# EasyEDA Pro project ProProject_EquiCycle_2024-03-26.epro, schematic Schematic1
Create Date: 2024-03-20; Page Name: P1; Project Name: EquiCycle; Schematic Name: Schematic1; Update Date: 2024-03-25; Company: 嘉立创EDA; Page Size: A4; Version: V1.0
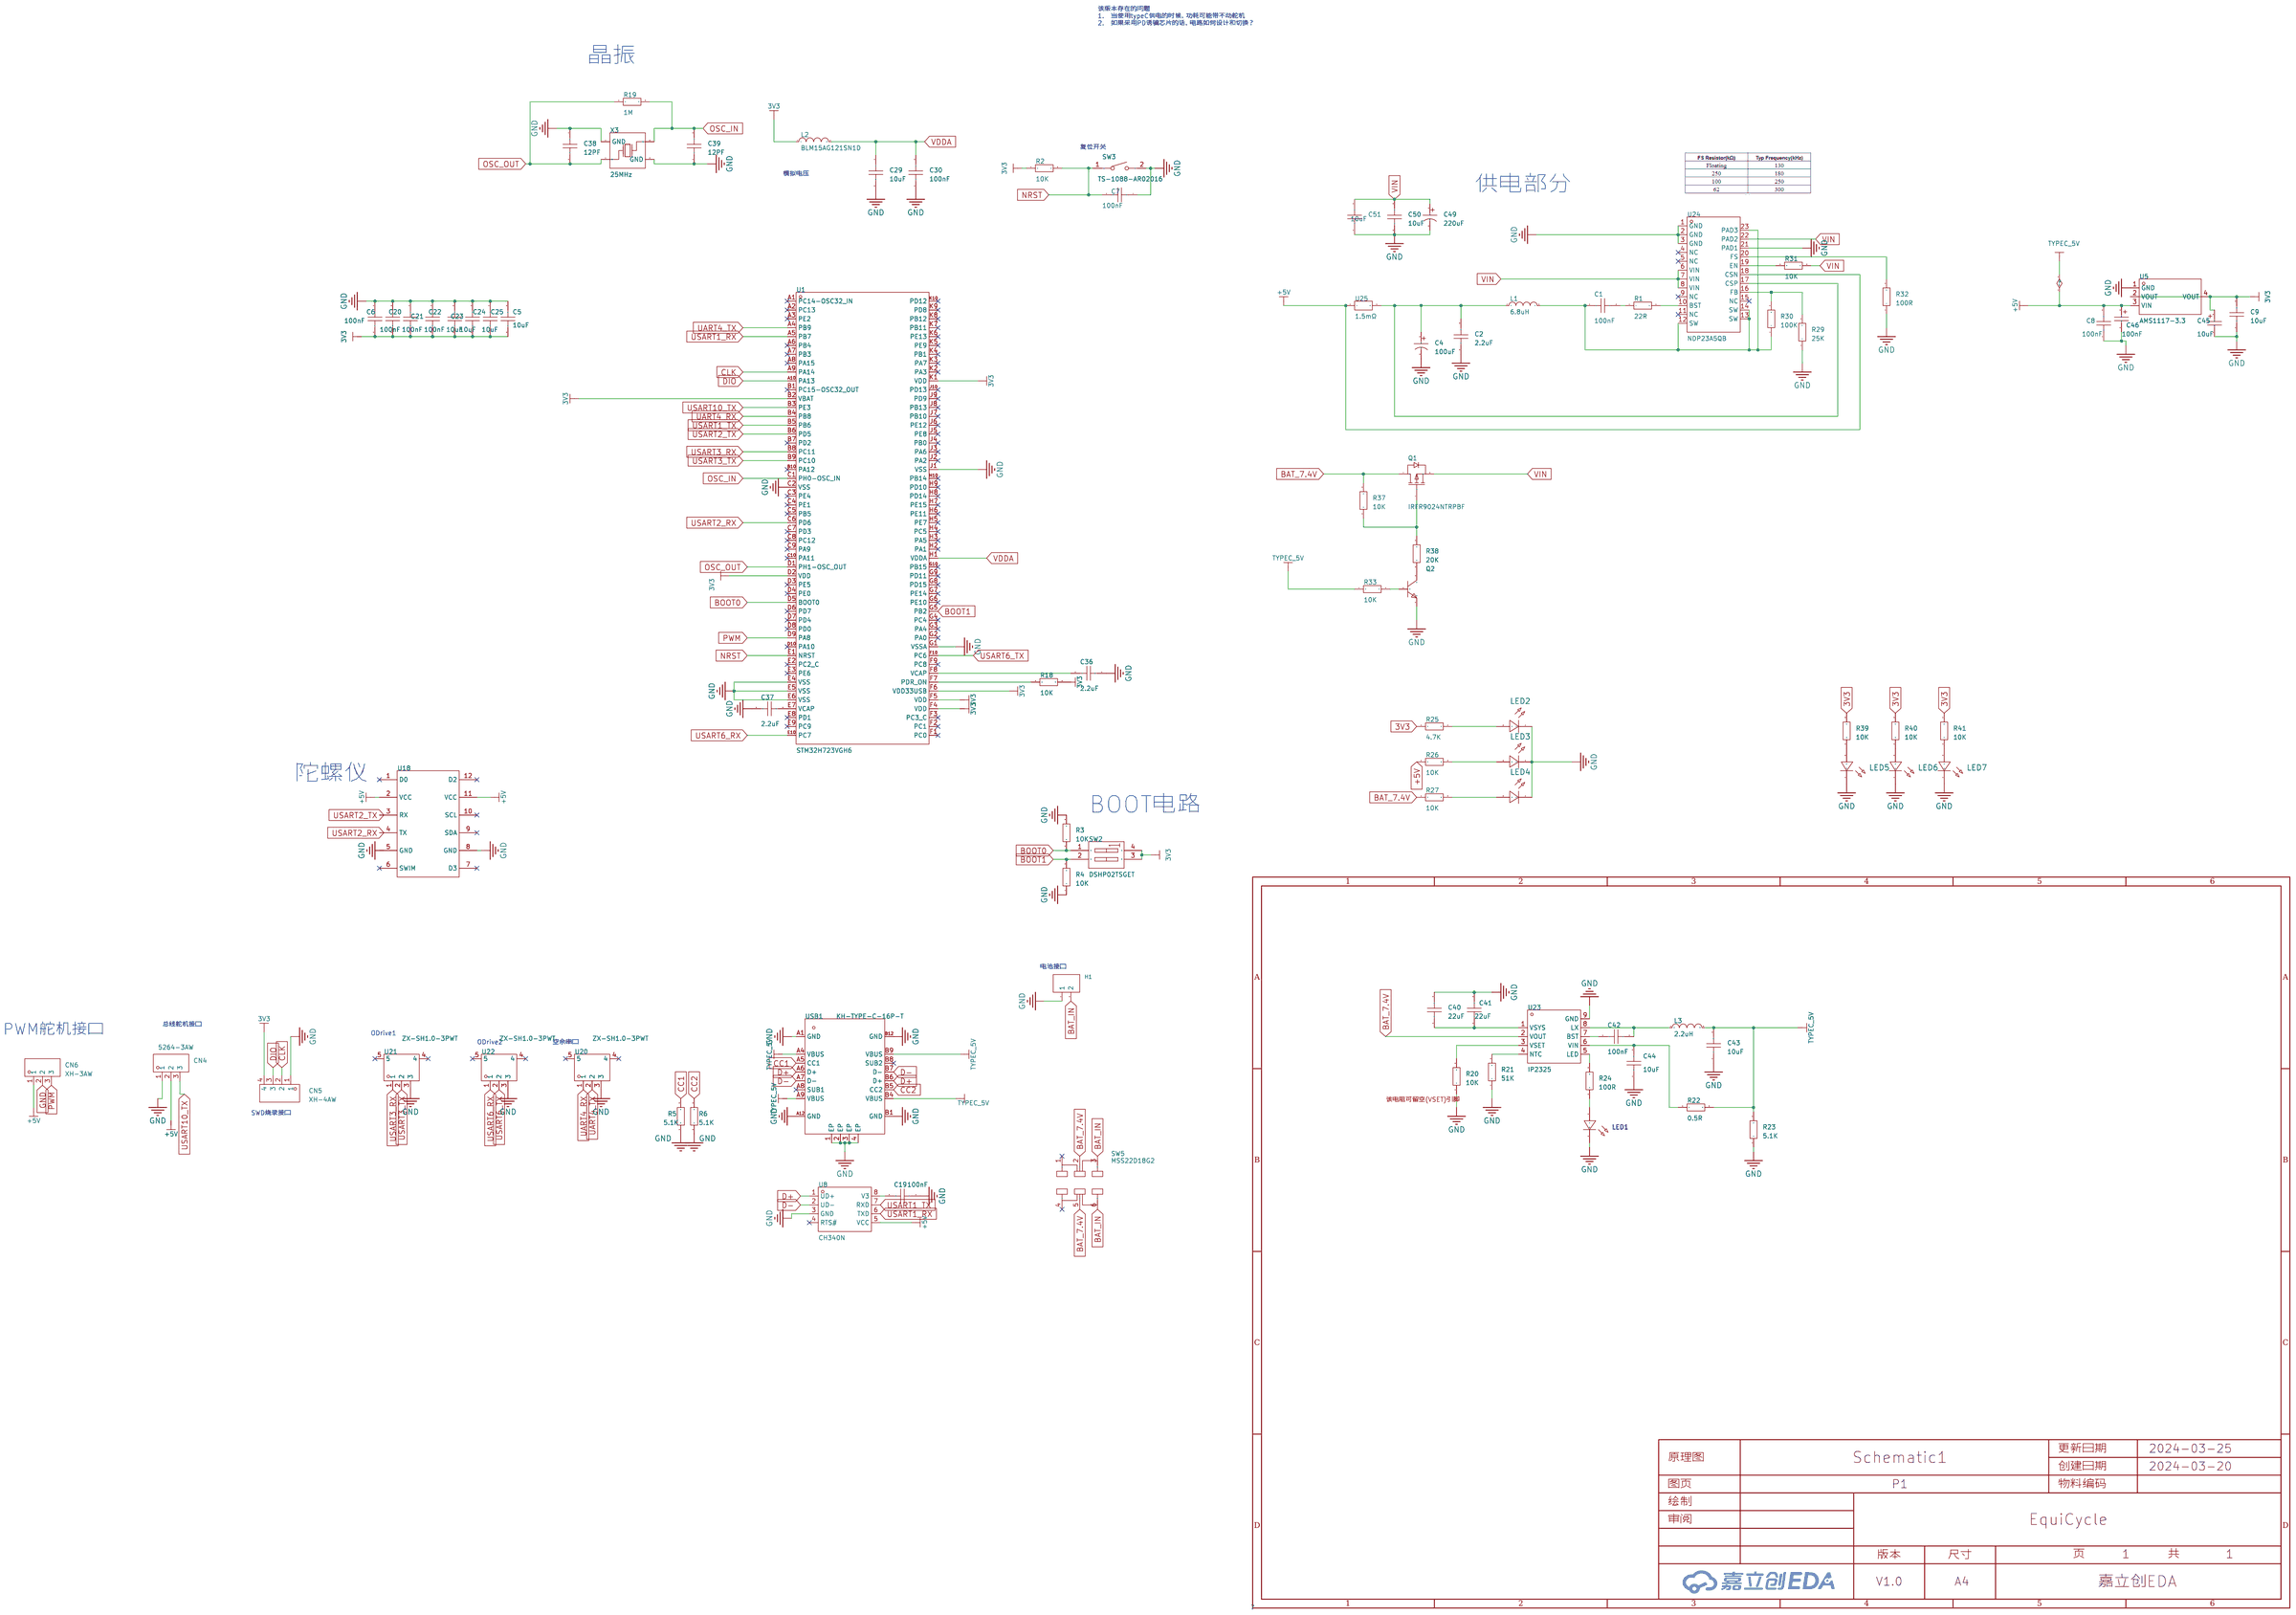
[diagram p0: schematic sheet]

## Parts
C1  100nF  [C0603]
C2  2.2uF  [C0603]
C4  100uF  [CAP-SMD_BD6.3-L6.6-W6.6-FD]
C5  10uF  [C0603]
C6  100nF  [C0603]
C7  100nF  [C0603]
C8  100nF  [C0603]
C9  10uF  [C0603]
C19  100nF  [C0603]
C20  100nF  [C0603]
C21  100nF  [C0603]
C22  100nF  [C0603]
C23  10uF  [C0603]
C24  10uF  [C0603]
C25  10uF  [C0603]
C29  10uF  [C0603]
C30  100nF  [C0603]
C36  2.2uF  [C0603]
C37  2.2uF  [C0603]
C38  12PF  [C0603]
C39  12PF  [C0603]
C40  22uF  [C0603]
C41  22uF  [C0603]
C42  100nF  [C0603]
C43  10uF  [C0603]
C44  10uF  [C0603]
C45  10uF  [CAP-SMD_L3.2-W1.6-RD-C7171]
C46  100nF  [CASE-A_3216]
C49  220uF  [CAP-SMD_BD6.3-L6.6-W6.6-FD]
C50  10uF  [C1206]
C51  10uF  [C1206]
CN4  5264-3AW  [CONN-TH_5264-3AW_C2839672]
CN5  XH-4AW  [CONN-TH_XH-4AW]
CN6  XH-3AW  [CONN-TH_3P-P2.54_HCTL_XH-3AW]
H1  -  [HDR-TH_2P-P2.54-V-F]
L1  6.8uH  [IND-SMD_L7.3-W6.6]
L2  BLM15AG121SN1D  [L0402]
L3  2.2uH  [IND-SMD_L4.0-W4.0]
LED1  -  [LED_0603]
LED2  -  [LED_0603]
LED3  -  [LED_0603]
LED4  -  [LED_0603]
LED5  -  [LED_0603]
LED6  -  [LED_0603]
LED7  -  [LED_0603]
Q1  IRFR9024NTRPBF  [TO-252-2_L6.6-W6.1-P4.58-LS9.9-TR]
Q2  -  [S8050_SOT-23]
R1  22R  [R0603]
R2  10K  [R0603]
R3  10K  [R0603]
R4  10K  [R0603]
R5  5.1K  [R0603]
R6  5.1K  [R0603]
R18  10K  [R0603]
R19  1M  [R0603]
R20  10K  [R0603]
R21  51K  [R0603]
R22  0.5R  [R0603]
R23  5.1K  [R0603]
R24  100R  [R0603]
R25  4.7K  [R0603]
R26  10K  [R0603]
R27  10K  [R0603]
R29  25K  [R0603]
R30  100K  [R0603]
R31  10K  [R0603]
R32  100R  [R0603]
R33  10K  [R0603]
R37  10K  [R0603]
R38  20K  [R0603]
R39  10K  [R0603]
R40  10K  [R0603]
R41  10K  [R0603]
SW2  DSHP02TSGET  [SW-SMD_4P_DSHP02TSGET]
SW3  TS-1088-AR02016  [SW-SMD_L3.9-W3.0-P4.45]
SW5  MSS22D18G2  [SW-TH_MSS22D18GX]
U1  STM32H723VGH6  [TFBGA-100_L8.0-W8.0-R10-C10-P0.80-BL]
U5  AMS1117-3.3  [SOT-223-3_L6.5-W3.4-P2.30-LS7.0-BR]
U8  CH340N  [SOP-8_L4.9-W3.9-P1.27-LS6.0-BL]
U18  -  [YJ62]
U20  ZX-SH1.0-3PWT  [CONN-SMD_3P-P1.00_MEGASTAR_ZX-SH1.0-3PWT]
U21  ZX-SH1.0-3PWT  [CONN-SMD_3P-P1.00_MEGASTAR_ZX-SH1.0-3PWT]
U22  ZX-SH1.0-3PWT  [CONN-SMD_3P-P1.00_MEGASTAR_ZX-SH1.0-3PWT]
U23  IP2325  [ESOP-8_L4.9-W3.9-P1.27-LS6.0-BL-EP]
U24  NDP23A5QB  [QFN-20_L5.0-W5.0-P0.80-TL-NDP1460QB]
U25  1.5mΩ  [R2512]
USB1  KH-TYPE-C-16P-T  [USB-C-SMD_KH-TYPE-C-16P]
X3  25MHz  [CRYSTAL-SMD_4P-L3.2-W2.5-BL]

## Library data of the parts
C1 C2 C5 C6 C8 C9 C19-C25 C29 C30 C36-C44 = CAP_0603: Supplier Footprint: 0603
C4 C49 = EEEFT1V101AP: 容值:100uF;精度:±20%;额定电压:35V;纹波电流:300mA@100kHz;等效串联电阻:260mΩ@100kHz;; LCSC Part Name: 100uF ±20% 35V; Supplier Part: C128464; Manufacturer: PANASONIC(松下); Supplier Footprint: SMD,D6.3xL5.8mm; JLCPCB Part Class: 扩展库; Datasheet: https://atta.szlcsc.com/upload/public/pdf/source/20170824/C128464_1503566119379907315.pdf; Supplier: LCSC; Tolerance: ±20%; Rated Voltage: 35V; Ripple Current: 300mA@100kHz; Equivalent Series Resistance(ESR): 260mΩ@100kHz; φD: 6.3mm; L: 6.1mm; Lifetime @ Temp: 2000hrs@105℃; Operating Temperature: -55℃~+105℃
C7 = CC0603KRX7R9BB104: 容值:100nF;精度:±10%;额定电压:50V;材质(温度系数):X7R;; LCSC Part Name: 100nF ±10% 50V; Supplier Part: C14663; Manufacturer: YAGEO(国巨); Supplier Footprint: 0603; JLCPCB Part Class: Basic Part; Datasheet: https://atta.szlcsc.com/upload/public/pdf/source/20170116/1484561234239.pdf; Supplier: LCSC; Tolerance: ±10%; Voltage Rated: 50V; Temperature Coefficient: X7R
C45 = TAJA106K016RNJ: 容值:10uF;精度:±10%;额定电压:16V;等效串联电阻:3Ω@100kHz;; LCSC Part Name: 10uF ±10% 16V; Supplier Part: C7171; Manufacturer: Kyocera AVX; Supplier Footprint: CASE-A-3216; JLCPCB Part Class: 基础库; Datasheet: https://atta.szlcsc.com/upload/public/pdf/source/20160107/1457707750344.pdf; Supplier: LCSC; Tolerance: ±10%; Rated Voltage: 16V; Equivalent Series Resistance(ESR): 3Ω@100kHz; Operating Temperature: -55℃~+125℃
C46 = TAJA104K035RNJ: 容值:100nF;精度:±10%;额定电压:35V;等效串联电阻:24Ω@100kHz;; LCSC Part Name: 100nF ±10% 35V; Supplier Part: C7173; Manufacturer: Kyocera AVX; Supplier Footprint: CASE-A-3216; JLCPCB Part Class: 扩展库; Datasheet: https://atta.szlcsc.com/upload/public/pdf/source/20160107/1457707750344.pdf; Supplier: LCSC; Tolerance: ±10%; Rated Voltage: 35V; Equivalent Series Resistance(ESR): 24Ω@100kHz; Operating Temperature: -55℃~+125℃
C50 C51 = CAP_1206: Supplier Footprint: 1206
CN4 = 5264-3AW_C2839672: LCSC Part Name: 1x3P 2.5mm; Supplier Part: C2839672; Manufacturer: FG(富港); Supplier Footprint: 弯插,P=2.5mm; JLCPCB Part Class: 扩展库; Datasheet: https://atta.szlcsc.com/upload/public/pdf/source/20210616/C2839671_9B30CBA3C870C6771A0032C00B036052.pdf; Supplier: LCSC
CN5 = XH-4AW: 插针结构:1x4P;间距:2.54mm;安装方式:弯插;参考系列:XH;总PIN数:4P;排数:1;每排PIN数:4;行距:-;额定电流:3A;触头材质:黄铜;触头镀层:锡;工作温度范围:-25℃~+85℃;; LCSC Part Name: 1x4P 间距:2.54mm 弯插 系列:XH; Supplier Part: C2908613; Manufacturer: HCTL(华灿天禄); Supplier Footprint: 弯插,P=2.54mm; JLCPCB Part Class: 扩展库; Datasheet: https://atta.szlcsc.com/upload/public/pdf/source/20230711/B565BAF3B11666EF6B81B3605408F2BD.pdf; Supplier: LCSC; Pins Structure: 1x4P; Pitch: 2.54mm; Mounting Style: 弯插; Reference Series: XH; Number of Pins: 4P; Number of Rows: 1; Number of PINs Per Row: 4; Current Rating (Max): 3A; Contact Material: 黄铜; Contact Plating: 锡; Operating Temperature Range: -25℃~+85℃
CN6 = XH-3AW_C2908612: 插针结构:1x3P;间距:2.54mm;安装方式:弯插;参考系列:XH;总PIN数:3P;排数:1;每排PIN数:3;行距:-;额定电流:3A;触头材质:黄铜;触头镀层:锡;工作温度范围:-25℃~+85℃;; LCSC Part Name: 1x3P 间距:2.54mm 弯插 系列:XH; Supplier Part: C2908612; Manufacturer: HCTL(华灿天禄); Supplier Footprint: 弯插,P=2.54mm; JLCPCB Part Class: Extended Part; Datasheet: https://atta.szlcsc.com/upload/public/pdf/source/20230711/B565BAF3B11666EF6B81B3605408F2BD.pdf; Supplier: LCSC; Pins Structure: 1x3P; Pitch: 2.54mm; Mounting Style: 弯插; Reference Series: XH; Number of Pins: 3P; Number of Rows: 1; Number of PINs Per Row: 3; Current Rating (Max): 3A; Contact Material: 黄铜; Contact Plating: 锡; Operating Temperature Range: -25℃~+85℃
H1 = HDR-F_2.54_1x2P: Supplier Part: C49661; Supplier Footprint: 插件
L1 = MCS0630-4R7MPY1: 电感值:4.7uH;精度:±20%;额定电流:5.5A;饱和电流(Isat):7A;; LCSC Part Name: 4.7uH ±20% 7A; Supplier Part: C2937097; Manufacturer: PSA(信昌电陶); Supplier Footprint: 0630; JLCPCB Part Class: Extended Part; Datasheet: https://atta.szlcsc.com/upload/public/pdf/source/20220121/EA6E6E6F70ED7BAE67EC293805EAAACB.pdf; Supplier: LCSC; Tolerance: ±20%; Rated Current: 5.5A; Saturation Current (Isat): 7A; DC Resistance (DCR): 37mΩ
L2 = BLM15AG121SN1D: 标称阻抗@测试频率:120Ω@100MHz;误差:±25%;直流电阻(RDC):190mΩ;; LCSC Part Name: 单路 0402磁珠 阻抗120Ω@100MHz; Supplier Part: C85812; Manufacturer: muRata(村田); Supplier Footprint: 0402; JLCPCB Part Class: 扩展库; Datasheet: https://atta.szlcsc.com/upload/public/pdf/source/20181120/C333978_3E581FB55966932B05020139ABDE8E01.pdf; Supplier: LCSC; Impedance @ Frequency: 120Ω@100MHz; Tolerance: ±25%; DC Resistance: 190mΩ; Current Rating: 500mA; Circuits: 1
L3 = YNR4030-2R2M: 电感值:2.2uH;精度:±20%;额定电流:2.95A;; LCSC Part Name: 2.2uH ±20%; Supplier Part: C340389; Manufacturer: YJYCOIN(益嘉源); Supplier Footprint: SMD,4x4x3mm; JLCPCB Part Class: 扩展库; Datasheet: https://atta.szlcsc.com/upload/public/pdf/source/20200623/C340386_9AA10DB3E9692149FF2BB278AFBCE083.pdf; Supplier: LCSC; Tolerance: ±20%; Rated Current: 2.95A; DC Resistance (DCR): 30mΩ
LED1 = LED_0603-G: Supplier Footprint: 0603
LED2-LED7 = LED_0603-R: Supplier Footprint: 0603
Q1 = IRFR9024NTRPBF: 类型:P沟道;漏源电压(Vdss):55V;连续漏极电流(Id):11A;功率(Pd):38W;导通电阻(RDS(on)@Vgs,Id):175mΩ@10V,6.6A;阈值电压(Vgs(th)@Id):4V@250uA;; LCSC Part Name: P沟道 耐压:55V 电流:11A; Supplier Part: C2585; Manufacturer: Infineon(英飞凌); Supplier Footprint: TO-252-2(DPAK); JLCPCB Part Class: 扩展库; Datasheet: https://atta.szlcsc.com/upload/public/pdf/source/20231227/C5C9E06882880E091BF906E6614F2461.pdf; Supplier: LCSC; Type: P沟道; Drain Source Voltage (Vdss): 55V; Continuous Drain Current (Id): 11A; Power Dissipation (Pd): 38W; Drain Source On Resistance (RDS(on)@Vgs,Id): 175mΩ@10V,6.6A; Gate Threshold Voltage (Vgs(th)@Id): 4V@250uA; Total Gate Charge (Qg@Vgs): 19nC@10V; Input Capacitance (Ciss@Vds): 350pF@25V; Operating Temperature: -55℃~+150℃@(Tj)
Q2 = S8050_SOT_NPN: Supplier Footprint: SOT-23
R1-R6 R18-R27 R29-R33 R37-R41 = Res_0603: Supplier Footprint: 0603
SW2 = DSHP02TSGET: 类型:平拨,凹槽式;电路结构:单刀单掷;开关位数:2位;使用寿命:-;颜色:黑色;; LCSC Part Name: 2位 1.27间距; Supplier Part: C40735; Manufacturer: YE; Supplier Footprint: SMD-4P,4.1x5.4mm; JLCPCB Part Class: 扩展库; Datasheet: https://atta.szlcsc.com/upload/public/pdf/source/20230904/D79341BE29271F006F9CB44DF18F7895.pdf; Supplier: LCSC; Type: 平拨,凹槽式; Circuit: 单刀单掷; Number of Positions: 2位; Lead Pitch: 1.27mm; Color: 黑色
SW3 = TS-1088-AR02016: 电路结构:单刀单掷;按钮形状:圆形按钮;作用力:160gf;安装方式:立贴;开关长度:4mm;开关宽度:3mm;开关高度:2mm;带支架:不带;触点电流:50mA;额定电压(DC):12V;绝缘电阻:100MΩ;机械寿命:10万次;; LCSC Part Name: 4*3*2mm 立贴 轻触开关; Supplier Part: C720477; Manufacturer: XUNPU(讯普); Supplier Footprint: SMD; JLCPCB Part Class: 扩展库; Datasheet: https://atta.szlcsc.com/upload/public/pdf/source/20200810/C720475_60D09DD6C54279ADDB2DC25100F1CC11.pdf; Supplier: LCSC; Circuit: 单刀单掷; Actuator Style: 圆形按钮; Operating Force: 160gf; Mounting Style: 立贴; Switch Length: 4mm; Switch Width: 3mm; Switch Height: 2mm; Strike Gundam: 不带; Contact Current: 50mA; Voltage Rating (DC): 12V; Insulation Resistance: 100MΩ; Actuator/Cap Color: 黑色; Pin Style: SMD接片; Mechanical Life: 10万次; Operating Temperature: -30℃~+80℃
SW5 = MSS22D18G2: 电路结构:双刀双掷;安装方式:直插;开关颜色:-;额定电流(DC):100mA;额定电压(DC):12V;额定电流(AC):-;额定电压(AC):-;机械寿命:1万次;; LCSC Part Name: 两档立式插件 6脚拨动 柄长2.0MM; Supplier Part: C431542; Manufacturer: SHOU HAN(首韩); Supplier Footprint: 插件-6P,3.5x9.1mm; JLCPCB Part Class: 扩展库; Datasheet: https://atta.szlcsc.com/upload/public/pdf/source/20190925/C431542_E050BEEB1B86229ABAC8A73C9D45E525.pdf; Supplier: LCSC; Circuit: 双刀双掷; Pin Style: SMD接片; Switch Length: 9.1mm; Switch Width: 3.5mm; Switch Height: 3.5mm; Mounting Style: 直插; Current Rating (DC): 100mA; Voltage Rating (DC): 12V; Mechanical Life: 1万次; Operating Temperature: -10℃~+50℃
U1 = STM32H723VGH6: CPU内核:ARM-M系列;程序存储容量:1MB;GPIO端口数量:80;工作电压范围:1.62V~3.6V;CPU最大主频:550MHz;程序存储器类型:-;应用领域:-;; Supplier Part: C2848033; Manufacturer: ST(意法半导体); Supplier Footprint: TFBGA-100(8x8x0.8); JLCPCB Part Class: 扩展库; Datasheet: https://atta.szlcsc.com/upload/public/pdf/source/20221107/3FC9BFF347BA16183E5CC96DF77651E2.pdf; Supplier: LCSC; CPU Core: ARM-M系列; Program Storage Size: 1MB; GPIO Ports Number: 80; Operating Voltage Range: 1.62V~3.6V; CPU Maximum Speed: 550MHz; Operating Temperature Range: -40℃~+125℃; ADC (Bit): 12bit；16bit; DAC (Bit): 12bit; 16Bit Timer: 10; 32Bit Timer: 4; I2C: 4; I2S: 5; SPI: 5; Universal Serial Bus: 有; Watchdog: 有; Real-Time Clock: 有; Low-Voltage Detect: 有; Secure Digital Input and Output: 有; Direct Memory Access: 有
U5 = AMS1117-3.3_C6186: 输出类型:固定;最大输入电压:-;输出电压:3.3V;最大输出电流:1A;电源纹波抑制比(PSRR):72dB@(120Hz);输出极性:正极;; LCSC Part Name: 输出3.3V 1A; Supplier Part: C6186; Manufacturer: AMS; Supplier Footprint: SOT-223-3; JLCPCB Part Class: 基础库; Datasheet: https://atta.szlcsc.com/upload/public/pdf/source/20180727/C6186_7A095716F0823C02F1997A905E26C086.pdf; Supplier: LCSC; Output Type: 固定; Output Voltage: 3.3V; MAX Output Current: 1A; Power Supply Rejection Ratio (PSRR): 72dB@(120Hz); Dropout Voltage: 1.3V@(800mA); Output Polarity: 正极; Number of Outputs: 1
U8 = CH340N: LCSC Part Name: USB转串口芯片 CH340; Supplier Part: C2977777; Manufacturer: WCH(南京沁恒); Supplier Footprint: SOP-8; JLCPCB Part Class: 扩展库; Datasheet: https://atta.szlcsc.com/upload/public/pdf/source/20230530/6E401E9554E9F5311886CC8B3F89B62E.pdf; Supplier: LCSC
U18 = JY62
U20-U22 = ZX-SH1.0-3PWT: 插针结构:1x3P;间距:1mm;安装方式:卧贴;参考系列:SH;总PIN数:3P;排数:1;每排PIN数:3;行距:-;额定电流:1A;触头材质:黄铜;触头镀层:锡;工作温度范围:-25℃~+85℃;; Supplier Part: C7430445; Manufacturer: Megastar(兆星); Supplier Footprint: SMD,P=1mm,卧贴; JLCPCB Part Class: 扩展库; Datasheet: https://atta.szlcsc.com/upload/public/pdf/source/20230619/CFE52D4011A035D5D140AE40938A4C7D.pdf; Supplier: LCSC; Pins Structure: 1x3P; Pitch: 1mm; Mounting Style: 卧贴; Reference Series: SH; Number of Pins: 3P; Number of Rows: 1; Number of PINs Per Row: 3; Current Rating (Max): 1A; Contact Material: 黄铜; Contact Plating: 锡; Operating Temperature Range: -25℃~+85℃
U23 = IP2325: Supplier Part: C605434; Manufacturer: INJOINIC(英集芯); Supplier Footprint: ESOP-8; JLCPCB Part Class: 扩展库; Datasheet: https://atta.szlcsc.com/upload/public/pdf/source/20200610/C605434_E37CCD504E40C8F43184D4B3B57194A6.pdf; Supplier: LCSC
U24 = NDP23A5QB: Supplier Part: C7420591; Manufacturer: NDP(芯潭微); Supplier Footprint: QFN-20-EP(5x5); Datasheet: https://atta.szlcsc.com/upload/public/pdf/source/20240115/E570BB22069506AA0F1179C170B94C5B.pdf; Supplier: LCSC
U25 = HoJLR2512-3W-1.5mR-1%: 电阻类型:采样电阻;阻值:1.5mΩ;精度:±1%;功率:3W;安装方式:贴片;; LCSC Part Name: 1.5mΩ ±1% 3W; Supplier Part: C2904233; Manufacturer: Milliohm(毫欧); Supplier Footprint: 2512; Datasheet: https://atta.szlcsc.com/upload/public/pdf/source/20211009/7525CABAB363C979E942C1DD41F1FEF0.pdf; Supplier: LCSC; Type: 采样电阻; Tolerance: ±1%; Power(Watts): 3W; Mounting Sytle: 贴片
USB1 = KH-TYPE-C-16P-T: 连接器类型:Type-C;标准:-;公母:母;端口数量:1;触点数量:16P;安装方式:卧贴;额定电流 - 电源:500mA;工作温度范围:-30℃~+80℃;; LCSC Part Name: Type-C 母 卧贴; Supplier Part: C709358; Manufacturer: kinghelm(金航标); Supplier Footprint: SMD; JLCPCB Part Class: 扩展库; Datasheet: https://atta.szlcsc.com/upload/public/pdf/source/20200722/C709358_5A99A991362FD50EC94EB58A838F95BB.pdf; Supplier: LCSC; Connector Type: Type-C; Gender: 母; Number of Ports: 1; Number of Contacts: 16P; Mounting Style: 卧贴; Current Rating - Power (Max): 500mA; Operating Temperature Range: -30℃~+80℃
X3 = X1E0000210139: 晶振类型:贴片晶振;频率:25MHz;常温频差:±10ppm;外接负载电容:12pF;; LCSC Part Name: 25MHz ±10ppm 12pF; Supplier Part: C91750; Manufacturer: EPSON(爱普生); Supplier Footprint: SMD3225-4P; JLCPCB Part Class: 扩展库; Datasheet: https://atta.szlcsc.com/upload/public/pdf/source/20180822/C255942_D265278E6344B989D9430C320788A855.pdf; Supplier: LCSC; Crystal Type: 贴片晶振; Normal temperature Frequency Tolerance: ±10ppm; External load capacitor: 12pF; Equivalent Series Resistance (ESR): 40Ω; Operating Temperature: -40℃~+85℃

## Nets
3V3: C5.2 C6.2 C9.2 C20.2 C21.2 C22.2 C23.2 C24.2 C25.2 C45.1 CN5.4 L2.1 R2.1 R18.2 R25.1 R39.2 R40.2 R41.2 SW2.3(B2) SW2.4(B1) U1.B2(VBAT) U1.D2(VDD) U1.F4(VDD) U1.F5(VDD) U1.F6(VDD33USB) U1.K1(VDD) U5.2(VOUT) U5.4(VOUT)
+5V: C8.2 C43.2 C46.1 CN4.2 CN6.1 L3.2 R22.2 R23.2 R26.1 R33.1 U5.3(VIN) U8.5(VCC) U18.2(VCC) U18.11(VCC) U24.18(CSN) U25.1 USB1.A4(VBUS) USB1.A9(VBUS) USB1.B4(VBUS) USB1.B9(VBUS)
GND: C2.1 C4.2 C5.1 C6.1 C7.1 C8.1 C9.1 C19.1 C20.1 C21.1 C22.1 C23.1 C24.1 C25.1 C29.2 C30.1 C36.1 C37.1 C38.1 C39.1 C40.2 C41.2 C43.1 C44.1 C45.2 C46.2 C49.2 C50.1 C51.1 CN4.1 CN5.1 CN6.2 H1.1 LED1.1(C) LED2.1(C) LED3.1(C) LED4.1(C) LED5.1(C) LED6.1(C) LED7.1(C) Q2.2 R3.2 R4.1 R5.1 R6.1 R20.1 R21.1 R23.1 R29.1 R32.1 SW3.2 U1.C2(VSS) U1.E4(VSS) U1.E5(VSS) U1.E6(VSS) U1.G1(VSSA) U1.J1(VSS) U5.1(GND) U8.3(GND) U18.5(GND) U18.8(GND) U20.3 U21.3 U22.3 U23.9(GND) U24.1(GND) U24.2(GND) U24.3(GND) U24.21(PAD1) USB1.1(EP) USB1.2(EP) USB1.3(EP) USB1.4(EP) USB1.A1(GND) USB1.A12(GND) USB1.B1(GND) USB1.B12(GND) X3.2(GND) X3.4(GND)
VDDA: C29.1 C30.2 L2.2 U1.H1(VDDA)
VIN: C49.1 C50.2 C51.2 Q1.3(S) R31.2 U24.6(VIN) U24.7(VIN) U24.8(VIN) U24.22(PAD2)
BAT_7.4V: Q1.4(D) R27.1 R37.2 SW5.2 SW5.5 U23.2(VOUT)
BAT_IN: H1.2 SW5.3 SW5.6
BOOT0: R3.1 SW2.1(A1) U1.D5(BOOT0)
BOOT1: R4.2 SW2.2(A2) U1.G5(PB2)
CC1: R5.2 USB1.A5(CC1)
CC2: R6.2 USB1.B5(CC2)
CLK: CN5.2 U1.A9(PA14)
D+: U8.1(UD+) USB1.A6(D+) USB1.B6(D+)
D-: U8.2(UD-) USB1.A7(D-) USB1.B7(D-)
DIO: CN5.3 U1.A10(PA13)
NRST: C7.2 R2.2 SW3.1 U1.E1(NRST)
OSC_IN: C39.2 R19.2 U1.C1(PH0-OSC_IN) X3.3(OSC2)
OSC_OUT: C38.2 R19.1 U1.D1(PH1-OSC_OUT) X3.1(OSC1)
PWM: CN6.3 U1.D9(PA8)
UART4_RX: U1.B4(PB8) U20.1
UART4_TX: U1.A4(PB9) U20.2
USART1_RX: U1.A5(PB7) U8.6(TXD)
USART1_TX: U1.B5(PB6) U8.7(RXD)
USART2_RX: U1.C6(PD6) U18.4(TX)
USART2_TX: U1.B6(PD5) U18.3(RX)
USART3_RX: U1.B8(PC11) U21.1
USART3_TX: U1.B9(PC10) U21.2
USART6_RX: U1.E10(PC7) U22.1
USART6_TX: U1.F10(PC6) U22.2
USART10_TX: CN4.3 U1.B3(PE3)
$1N11717: C36.2 U1.F8(VCAP)
$1N11758: C37.2 U1.E7(VCAP)
$1N11785: R18.1 U1.F7(PDR_ON)
$1N17298: C19.2 U8.8(V3)
$1N37765: C40.1 C41.1 U23.1(VSYS)
$1N37977: R20.2 U23.3(VSET)
$1N38061: R21.2 U23.4(NTC)
$1N38254: C42.1 U23.7(BST)
$1N38282: C42.2 L3.1 U23.8(LX)
$1N38371: C44.2 R22.1 U23.6(VIN)
$1N38697: R24.2 U23.5(LED)
$1N38723: LED1.2(A) R24.1
$1N38898: LED2.2(A) R25.2
$1N38997: LED3.2(A) R26.2
$1N39024: LED4.2(A) R27.2
$1N46795: R1.2 U24.10(BST)
$1N46796: C1.2 R1.1
$1N46798: R29.2 R30.2 U24.16(FB)
$1N46801: C2.2 C4.1 L1.1 U24.17(CSP) U25.2
$1N46802: R31.1 U24.19(EN)
$1N46804: R32.2 U24.20(FS)
$1N46808: C1.1 L1.2 R30.1 U24.12(SW) U24.13(SW) U24.14(SW) U24.23(PAD3)
$1N47261: Q2.1 R33.2
$1N52209: Q1.1(G) R37.1 R38.1
$1N52301: Q2.3 R38.2
$1N61169: LED5.2(A) R39.1
$1N61471: LED6.2(A) R40.1
$1N61551: LED7.2(A) R41.1

Not connected (* = marked no-connect by the designer): SW5 1* 4*; U1 A1(PC14-OSC32_IN)* A2(PC13)* A3(PE2)* A6(PB4)* A7(PB3)* A8(PA15)* B1(PC15-OSC32_OUT)* B7(PD2)* B10(PA12)* C3(PE4)* C4(PE1)* C5(PB5)* C7(PD3)* C8(PC12)* C9(PA9)* C10(PA11)* D3(PE5)* D4(PE0)* D6(PD7)* D7(PD4)* D8(PD0)* D10(PA10)* E2(PC2_C)* E3(PE6)* E8(PD1)* E9(PC9)* F1(PC0)* F2(PC1)* F3(PC3_C)* F9(PC8)* G2(PA0)* G3(PA4)* G4(PC4)* G6(PE10)* G7(PE14)* G8(PD15)* G9(PD11)* G10(PB15)* H2(PA1)* H3(PA5)* H4(PC5)* H5(PE7)* H6(PE11)* H7(PE15)* H8(PD14)* H9(PD10)* H10(PB14)* J2(PA2)* J3(PA6)* J4(PB0)* J5(PE8)* J6(PE12)* J7(PB10)* J8(PB13)* J9(PD9)* J10(PD13)* K2(PA3)* K3(PA7)* K4(PB1)* K5(PE9)* K6(PE13)* K7(PB11)* K8(PB12)* K9(PD8)* K10(PD12)*; U8 4(RTS#)*; U18 1(D0)* 6(SWIM)* 7(D3)* 9(SDA)* 10(SCL)* 12(D2)*; U20 4* 5*; U21 4* 5*; U22 4* 5*; U24 4(NC)* 5(NC)* 9(NC)* 11(NC)* 15(NC)*; USB1 A8(SUB1)* B8(SUB2)*

## Notes on the sheet
- 该版本存在的问题
  1.  当使用typeC供电的时候，功耗可能带不动舵机
  2.  如果采用PD诱骗芯片的话，电路如何设计和切换？
- 晶振
- 复位开关
- 模拟电压
- 供电部分
- 陀螺仪
- BOOT电路
- 电池接口
- 总线舵机接口
- PWM舵机接口
- ODrive1
- ODrive2
- 空余串口
- 该电阻可留空(VSET)引脚
- SWD烧录接口
